# Altium project STM32_Display.PrjPcb
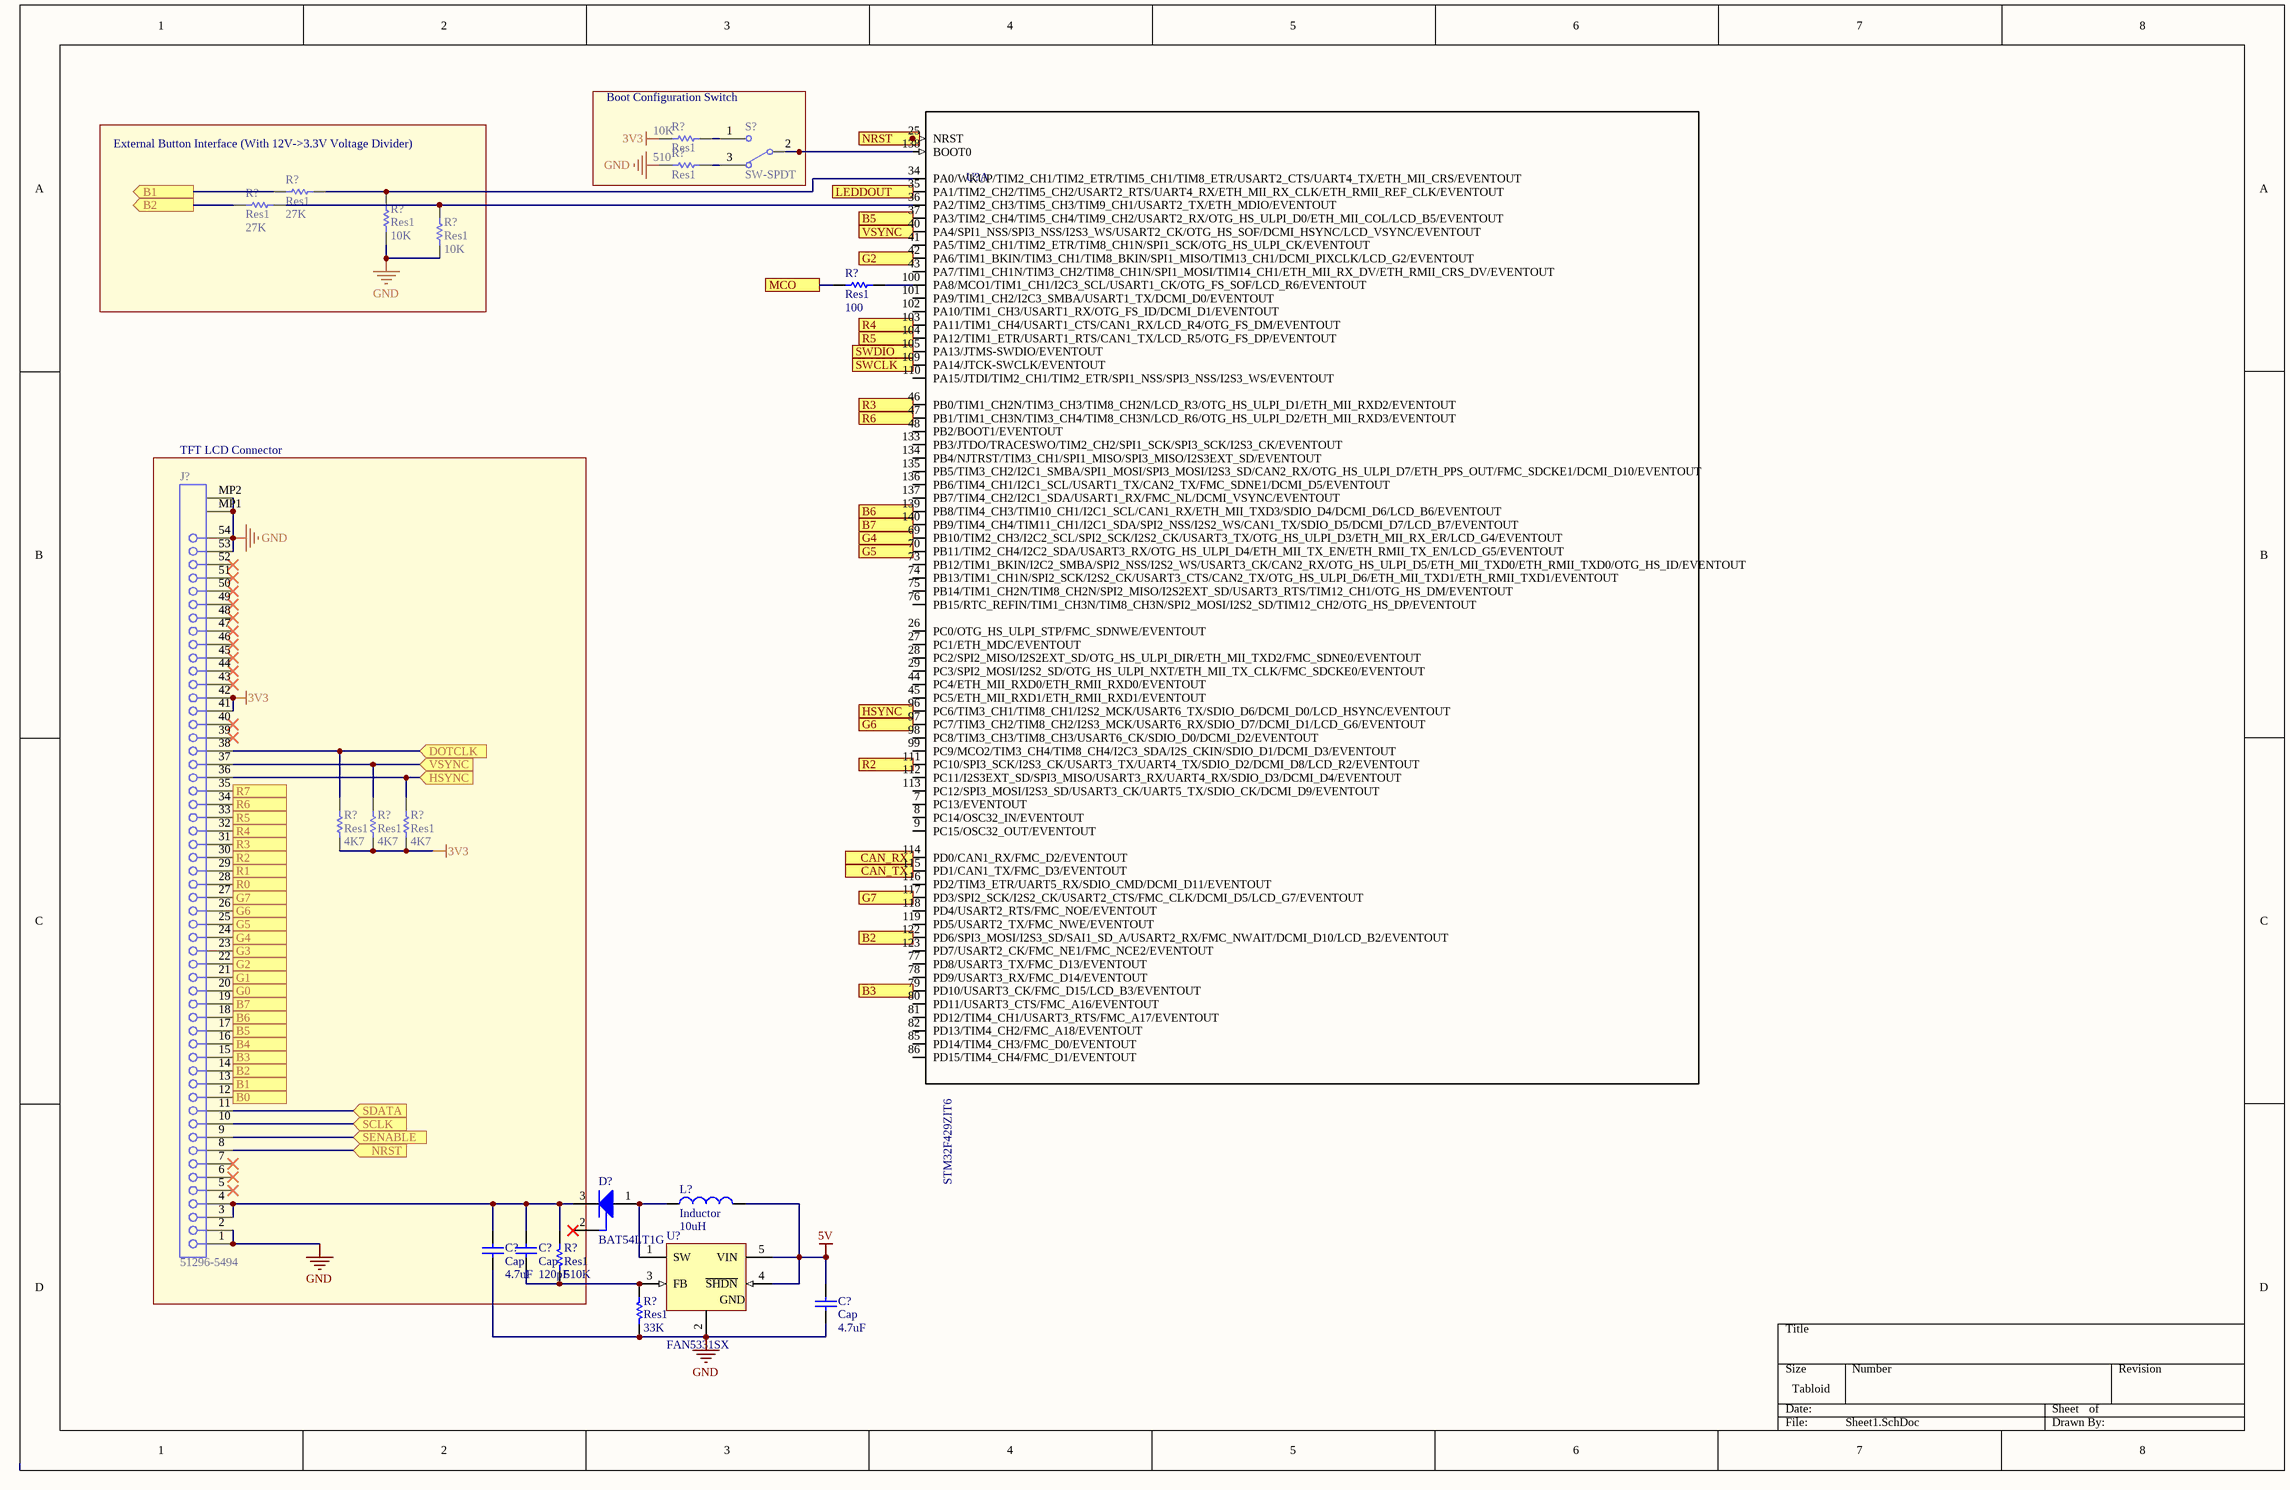
[diagram p0: Sheet1.SchDoc]
4 sheets, 108 parts. Net scope: flat (ports and power ports of the same name join across sheets).
Sheets:
  Sheet1.SchDoc
  Sheet2.SchDoc
  Sheet3.SchDoc
  Sheet4.SchDoc

## Sheet Sheet1.SchDoc
size Tabloid

### Parts
(Parts that share a designator on the sheet are numbered #1, #2 ... from top to bottom, then left to right.)
C?#1  Cap  value 4.7uF  [RAD-0.3]
C?#2  Cap  value 120pF  [RAD-0.3]
C?#3  Cap  value 4.7uF  [RAD-0.3]
D?  BAT54LT1G  [ONSC-SOT-23-3-318-08_V]
J?#1  51296-5494  [MOLX-51296-5494]
L?  Inductor  value 10uH  [0402-A]
R?#1  Res1  value 10K  [AXIAL-0.3]
R?#2  Res1  value 510  [AXIAL-0.3]
R?#3  Res1  value 27K  [AXIAL-0.3]
R?#4  Res1  value 27K  [AXIAL-0.3]
R?#5  Res1  value 10K  [AXIAL-0.3]
R?#6  Res1  value 10K  [AXIAL-0.3]
R?#7  Res1  value 100  [AXIAL-0.3]
R?#8  Res1  value 4K7  [AXIAL-0.3]
R?#9  Res1  value 4K7  [AXIAL-0.3]
R?#10  Res1  value 4K7  [AXIAL-0.3]
R?#11  Res1  value 510K  [AXIAL-0.3]
R?#12  Res1  value 33K  [AXIAL-0.3]
S?  SW-SPDT  [TL36WW15050]
U?#1  STM32F429ZIT6  [*QFP50P2200X2200X160-144N]  (part A of 2)
U?#2  FAN5331SX  [DBV0005A_L]

### Blocks framed on the sheet
Boot Configuration Switch: R?#1 R?#2 S?
External Button Interface (With 12V->3.3V Voltage Divider): R?#3-R?#6
TFT LCD Connector: C?#1 C?#2 J?#1 R?#8-R?#11

### Ports
B0 (in), B1 (in), B1 (out), B2 (in), B2 (out), B3 (in), B4 (in), B5 (in), B6 (in), B7 (in), CAN_RX, CAN_TX, DOTCLK (in), G0 (in), G1 (in), G2 (in), G3 (in), G4 (in), G5 (in), G6 (in), G7 (in), HSYNC (in), LEDDOUT, MCO, NRST (in), R0 (in), R1 (in), R2 (in), R3 (in), R4 (in), R5 (in), R6 (in), R7 (in), SCLK (in), SDATA (in), SENABLE (in), SWCLK (in), SWDIO (in), VSYNC (in)

### Nets
3V3: J?#1.41 J?#1.42 R?#1.1 R?#8.1 R?#9.1 R?#10.1
5V: C?#3.1 L?.1 U?#2.4(~{SHDN}) U?#2.5(VIN)
GND: C?#1.2 C?#3.2 J?#1.1 J?#1.2 J?#1.53 J?#1.54 J?#1.MP1 J?#1.MP2 R?#2.1 R?#5.1 R?#6.1 R?#12.1 U?#2.2(GND)
Net?#16_2: J?#1.8 ; port NRST
NetC?#1_1: C?#1.1 C?#2.1 D?.3(K) J?#1.3 J?#1.4 R?#11.2
NetC?#2_2: C?#2.2 R?#11.1 R?#12.2 U?#2.3(FB)
NetD?_1: D?.1(A) L?.2 U?#2.1(SW)
NetJ?#1_9: J?#1.9 ; port SENABLE
NetJ?#1_10: J?#1.10 ; port SCLK
NetJ?#1_11: J?#1.11 ; port SDATA
NetJ?#1_12: J?#1.12 ; port B0
NetJ?#1_13: J?#1.13 R?#3.2 ; port B1
NetJ?#1_14: J?#1.14 R?#4.2 U?#1.122(PD6/SPI3_MOSI/I2S3_SD/SAI1_SD_A/USART2_RX/FMC_NWAIT/DCMI_D10/LCD_B2/EVENTOUT) ; port B2
NetJ?#1_15: J?#1.15 U?#1.79(PD10/USART3_CK/FMC_D15/LCD_B3/EVENTOUT) ; port B3
NetJ?#1_16: J?#1.16 ; port B4
NetJ?#1_17: J?#1.17 U?#1.37(PA3/TIM2_CH4/TIM5_CH4/TIM9_CH2/USART2_RX/OTG_HS_ULPI_D0/ETH_MII_COL/LCD_B5/EVENTOUT) ; port B5
NetJ?#1_18: J?#1.18 U?#1.139(PB8/TIM4_CH3/TIM10_CH1/I2C1_SCL/CAN1_RX/ETH_MII_TXD3/SDIO_D4/DCMI_D6/LCD_B6/EVENTOUT) ; port B6
NetJ?#1_19: J?#1.19 U?#1.140(PB9/TIM4_CH4/TIM11_CH1/I2C1_SDA/SPI2_NSS/I2S2_WS/CAN1_TX/SDIO_D5/DCMI_D7/LCD_B7/EVENTOUT) ; port B7
NetJ?#1_20: J?#1.20 ; port G0
NetJ?#1_21: J?#1.21 ; port G1
NetJ?#1_22: J?#1.22 U?#1.42(PA6/TIM1_BKIN/TIM3_CH1/TIM8_BKIN/SPI1_MISO/TIM13_CH1/DCMI_PIXCLK/LCD_G2/EVENTOUT) ; port G2
NetJ?#1_23: J?#1.23 ; port G3
NetJ?#1_24: J?#1.24 U?#1.69(PB10/TIM2_CH3/I2C2_SCL/SPI2_SCK/I2S2_CK/USART3_TX/OTG_HS_ULPI_D3/ETH_MII_RX_ER/LCD_G4/EVENTOUT) ; port G4
NetJ?#1_25: J?#1.25 U?#1.70(PB11/TIM2_CH4/I2C2_SDA/USART3_RX/OTG_HS_ULPI_D4/ETH_MII_TX_EN/ETH_RMII_TX_EN/LCD_G5/EVENTOUT) ; port G5
NetJ?#1_26: J?#1.26 U?#1.97(PC7/TIM3_CH2/TIM8_CH2/I2S3_MCK/USART6_RX/SDIO_D7/DCMI_D1/LCD_G6/EVENTOUT) ; port G6
NetJ?#1_27: J?#1.27 U?#1.117(PD3/SPI2_SCK/I2S2_CK/USART2_CTS/FMC_CLK/DCMI_D5/LCD_G7/EVENTOUT) ; port G7
NetJ?#1_28: J?#1.28 ; port R0
NetJ?#1_29: J?#1.29 ; port R1
NetJ?#1_30: J?#1.30 U?#1.111(PC10/SPI3_SCK/I2S3_CK/USART3_TX/UART4_TX/SDIO_D2/DCMI_D8/LCD_R2/EVENTOUT) ; port R2
NetJ?#1_31: J?#1.31 U?#1.46(PB0/TIM1_CH2N/TIM3_CH3/TIM8_CH2N/LCD_R3/OTG_HS_ULPI_D1/ETH_MII_RXD2/EVENTOUT) ; port R3
NetJ?#1_32: J?#1.32 U?#1.103(PA11/TIM1_CH4/USART1_CTS/CAN1_RX/LCD_R4/OTG_FS_DM/EVENTOUT) ; port R4
NetJ?#1_33: J?#1.33 U?#1.104(PA12/TIM1_ETR/USART1_RTS/CAN1_TX/LCD_R5/OTG_FS_DP/EVENTOUT) ; port R5
NetJ?#1_34: J?#1.34 U?#1.47(PB1/TIM1_CH3N/TIM3_CH4/TIM8_CH3N/LCD_R6/OTG_HS_ULPI_D2/ETH_MII_RXD3/EVENTOUT) ; port R6
NetJ?#1_35: J?#1.35 ; port R7
NetJ?#1_36: J?#1.36 R?#10.2 U?#1.96(PC6/TIM3_CH1/TIM8_CH1/I2S2_MCK/USART6_TX/SDIO_D6/DCMI_D0/LCD_HSYNC/EVENTOUT) ; port HSYNC
NetJ?#1_37: J?#1.37 R?#9.2 U?#1.40(PA4/SPI1_NSS/SPI3_NSS/I2S3_WS/USART2_CK/OTG_HS_SOF/DCMI_HSYNC/LCD_VSYNC/EVENTOUT) ; port VSYNC
NetJ?#1_38: J?#1.38 R?#8.2 ; port DOTCLK
NetP?#2_2: U?#1.109(PA14/JTCK-SWCLK/EVENTOUT) ; port SWCLK
NetP?#2_4: U?#1.105(PA13/JTMS-SWDIO/EVENTOUT) ; port SWDIO
NetR?#1_2: R?#1.2 S?.1
NetR?#2_2: R?#2.2 S?.3
NetR?#3_1: R?#3.1 R?#5.2 U?#1.34(PA0/WKUP/TIM2_CH1/TIM2_ETR/TIM5_CH1/TIM8_ETR/USART2_CTS/UART4_TX/ETH_MII_CRS/EVENTOUT)
NetR?#4_1: R?#4.1 R?#6.2 U?#1.36(PA2/TIM2_CH3/TIM5_CH3/TIM9_CH1/USART2_TX/ETH_MDIO/EVENTOUT)
NetR?#7_1: R?#7.1 ; port MCO
NetR?#7_2: R?#7.2 U?#1.100(PA8/MCO1/TIM1_CH1/I2C3_SCL/USART1_CK/OTG_FS_SOF/LCD_R6/EVENTOUT)
NetS?_2: S?.2 U?#1.138(BOOT0)
NetU?#1_35: U?#1.35(PA1/TIM2_CH2/TIM5_CH2/USART2_RTS/UART4_RX/ETH_MII_RX_CLK/ETH_RMII_REF_CLK/EVENTOUT) ; port LEDDOUT
NetU?#1_114: U?#1.114(PD0/CAN1_RX/FMC_D2/EVENTOUT) ; port CAN_RX
NetU?#1_115: U?#1.115(PD1/CAN1_TX/FMC_D3/EVENTOUT) ; port CAN_TX

Not connected (* = marked no-connect by the designer): D? 2(NC)*; J?#1 5* 6* 7* 39* 40* 43* 44* 45* 46* 47* 48* 49* 50* 51* 52*; U?#1 7(PC13/EVENTOUT) 8(PC14/OSC32_IN/EVENTOUT) 9(PC15/OSC32_OUT/EVENTOUT) 25(NRST) 26(PC0/OTG_HS_ULPI_STP/FMC_SDNWE/EVENTOUT) 27(PC1/ETH_MDC/EVENTOUT) 28(PC2/SPI2_MISO/I2S2EXT_SD/OTG_HS_ULPI_DIR/ETH_MII_TXD2/FMC_SDNE0/EVENTOUT) 29(PC3/SPI2_MOSI/I2S2_SD/OTG_HS_ULPI_NXT/ETH_MII_TX_CLK/FMC_SDCKE0/EVENTOUT) 41(PA5/TIM2_CH1/TIM2_ETR/TIM8_CH1N/SPI1_SCK/OTG_HS_ULPI_CK/EVENTOUT) 43(PA7/TIM1_CH1N/TIM3_CH2/TIM8_CH1N/SPI1_MOSI/TIM14_CH1/ETH_MII_RX_DV/ETH_RMII_CRS_DV/EVENTOUT) 44(PC4/ETH_MII_RXD0/ETH_RMII_RXD0/EVENTOUT) 45(PC5/ETH_MII_RXD1/ETH_RMII_RXD1/EVENTOUT) 48(PB2/BOOT1/EVENTOUT) 73(PB12/TIM1_BKIN/I2C2_SMBA/SPI2_NSS/I2S2_WS/USART3_CK/CAN2_RX/OTG_HS_ULPI_D5/ETH_MII_TXD0/ETH_RMII_TXD0/OTG_HS_ID/EVENTOUT) 74(PB13/TIM1_CH1N/SPI2_SCK/I2S2_CK/USART3_CTS/CAN2_TX/OTG_HS_ULPI_D6/ETH_MII_TXD1/ETH_RMII_TXD1/EVENTOUT) 75(PB14/TIM1_CH2N/TIM8_CH2N/SPI2_MISO/I2S2EXT_SD/USART3_RTS/TIM12_CH1/OTG_HS_DM/EVENTOUT) 76(PB15/RTC_REFIN/TIM1_CH3N/TIM8_CH3N/SPI2_MOSI/I2S2_SD/TIM12_CH2/OTG_HS_DP/EVENTOUT) 77(PD8/USART3_TX/FMC_D13/EVENTOUT) 78(PD9/USART3_RX/FMC_D14/EVENTOUT) 80(PD11/USART3_CTS/FMC_A16/EVENTOUT) 81(PD12/TIM4_CH1/USART3_RTS/FMC_A17/EVENTOUT) 82(PD13/TIM4_CH2/FMC_A18/EVENTOUT) 85(PD14/TIM4_CH3/FMC_D0/EVENTOUT) 86(PD15/TIM4_CH4/FMC_D1/EVENTOUT) 98(PC8/TIM3_CH3/TIM8_CH3/USART6_CK/SDIO_D0/DCMI_D2/EVENTOUT) 99(PC9/MCO2/TIM3_CH4/TIM8_CH4/I2C3_SDA/I2S_CKIN/SDIO_D1/DCMI_D3/EVENTOUT) 101(PA9/TIM1_CH2/I2C3_SMBA/USART1_TX/DCMI_D0/EVENTOUT) 102(PA10/TIM1_CH3/USART1_RX/OTG_FS_ID/DCMI_D1/EVENTOUT) 110(PA15/JTDI/TIM2_CH1/TIM2_ETR/SPI1_NSS/SPI3_NSS/I2S3_WS/EVENTOUT) 112(PC11/I2S3EXT_SD/SPI3_MISO/USART3_RX/UART4_RX/SDIO_D3/DCMI_D4/EVENTOUT) 113(PC12/SPI3_MOSI/I2S3_SD/USART3_CK/UART5_TX/SDIO_CK/DCMI_D9/EVENTOUT) 116(PD2/TIM3_ETR/UART5_RX/SDIO_CMD/DCMI_D11/EVENTOUT) 118(PD4/USART2_RTS/FMC_NOE/EVENTOUT) 119(PD5/USART2_TX/FMC_NWE/EVENTOUT) 123(PD7/USART2_CK/FMC_NE1/FMC_NCE2/EVENTOUT) 133(PB3/JTDO/TRACESWO/TIM2_CH2/SPI1_SCK/SPI3_SCK/I2S3_CK/EVENTOUT) 134(PB4/NJTRST/TIM3_CH1/SPI1_MISO/SPI3_MISO/I2S3EXT_SD/EVENTOUT) 135(PB5/TIM3_CH2/I2C1_SMBA/SPI1_MOSI/SPI3_MOSI/I2S3_SD/CAN2_RX/OTG_HS_ULPI_D7/ETH_PPS_OUT/FMC_SDCKE1/DCMI_D10/EVENTOUT) 136(PB6/TIM4_CH1/I2C1_SCL/USART1_TX/CAN2_TX/FMC_SDNE1/DCMI_D5/EVENTOUT) 137(PB7/TIM4_CH2/I2C1_SDA/USART1_RX/FMC_NL/DCMI_VSYNC/EVENTOUT)

### Library data of the parts
C?#1-C?#3 = Cap: Capacitor; Published: 8-Jun-2000; LatestRevisionDate: 17-Jul-2002; LatestRevisionNote: Re-released for DXP Platform.; PackageReference: RAD-0.3; Publisher: Altium Limited; PackageDescription: Radial Cap, Thru-Hole; 2 Leads; 0.3 in Pin Spacing
D? = CMP-1055-00534-1: Schottky Barrier Diode, 3-Pin SOT-23, Pb-Free, Tape and Reel; Manufacturer: On Semiconductor; IFSM Max (A): 0.6; Configuration: Single; trr Max (ns): 5; PackageVersion: Rev. AP, 11/2009; ComponentLink3Description: Package Specification; RoHS: TRUE; ComponentLink3URL: http://www.onsemi.cn/pub_link/Collateral/318-08.PDF; PackageDescription: 3-Pin Small Outline Transistor, Body 2.92 x 1.3 mm, Pitch 0.95 mm; DatasheetVersion: Rev. 12; ComponentLink1Description: Manufacturer URL; PartNumber: BAT54LT1G; ComponentLink2Description: Datasheet; Mounting Technology: Surface Mount; PackageReference: SOT-23-3-318-08; ComponentLink2URL: http://www.onsemi.cn/pub_link/Collateral/BAT54LT1-D.PDF; ComponentLink1URL: http://www.onsemi.com/; Packing: Tape and Reel
J?#1 = CMP-1241-00166-1: 0.5 mm Pitch Easy-On(TM) Type FPC Connector, 1.3 mm Mated Height, Right Angle, ZIF, SMT, Bottom Contact, 54 Circuits, -20 to 85 degC, ELV and RoHS Compliant, Tape and Reel; Manufacturer: Molex; Entry Angle: 90degrees Angle; Pitch - Mating Interface: 0.50mm; Durability (mating cycles max): 20; Polarized to PCB: Yes; Voltage (Max): 50V AC (RMS)/DC; Material - Metal: Phosphor Bronze; Stackable: No; Mated Height: 1.30mm; Circuits (Loaded): 54; Material - Plating Termination: Gold; Current (Max per Contact): 0.5A; Contact Position: Bottom; Orientation: Right Angle; Number of Rows: 1; ComponentLink3Description: Package Specification; ComponentLink3URL: http://www.molex.com/pdm_docs/sd/512965494_sd.pdf; PackageVersion: Rev. G, 02/2011; ComponentLink1URL: http://www.molex.com/molex/index.jsp; PackageReference: 51296-5494; ComponentLink2Description: Datasheet; ComponentLink1Description: Manufacturer URL; Mounting Technology: Surface Mount; PCB Retention: Yes; PartNumber: 51296-5494; PCB Locator: No; ComponentLink2URL: http://www.molex.com/webdocs/datasheets/pdf/en-us/0512965494_FFC_FPC_CONNECTORS.pdf; PackageDescription: 54-Lead FPC Connector, Pitch 0.5 mm; Packing: Tape and Reel; Material - Plating Mating: Gold; RoHS: TRUE
L? = Inductor: Code_IEC: 1005; Published: 8-Jun-2000; LatestRevisionDate: 29-May-2009; LatestRevisionNote: IPC-7351 Footprint Added.; PackageReference: 0402-A; Publisher: Altium Limited; PackageDescription: Chip Inductor; Code_JEITA: 0402
R?#1-R?#12 = Res1: Resistor; Published: 8-Jun-2000; LatestRevisionDate: 17-Jul-2002; LatestRevisionNote: Re-released for DXP Platform.; PackageReference: AXIAL-0.3; Publisher: Altium Limited; PackageDescription: Axial Device, Thru-Hole; 2 Leads; 0.3 in Pin Spacing
S? = SW-SPDT: SPDT Subminiature Toggle Switch, Right Angle Mounting, Vertical Actuation; Published: 24-Mar-1999; LatestRevisionDate: 17-Dec-2003; LatestRevisionNote: Schematic revised, PCB Footprint replaced.; DatasheetVersion: 05-Dec-2000; PackageReference: TL36WW15050; Publisher: Altium Limited; PackageDescription: Switch; 4 Leads; ComponentLink1Description: Manufacturer Link; ComponentLink1URL: http://www.apem.com
U?#1 = STM32F429ZIT6: High-performance and DSP with FPU, ARM Cortex-M4 MCU with 2 Mbytes Flash, 180 MHz CPU, Art Accelerator, SDRAM, TFT; MF: STMicroelectronics; Digi-Key_Part_Number: 497-14053-ND; SnapEDA_Link: https://www.snapeda.com/parts/STM32F429ZIT6/STMicroelectronics/view-part/?ref=snap; MP: STM32F429ZIT6; Package: LQFP-144 STMicroelectronics; Digi-Key_Purchase_URL: https://www.digikey.com/product-detail/en/stmicroelectronics/STM32F429ZIT6/497-14053-ND/4357427?utm_source=snapeda&utm_medium=aggregator&utm_campaign=symbol; Value: *
U?#2 = CMP-0063-01104-3: Manufacturer: Texas Instruments; PackageTopMarking: S59B*XTT; CompType: MiscPower; PowerWise: N; ComponentLink1Description: Datasheet URL; ComponentLink1URL: http://www.ti.com/general/docs/lit/getliterature.tsp?genericPartNumber=LM2705&fileType=pdf; PinCount: 5; PackageDescription: Molded SOT-23, .115 x .063 x .040 in Body, 5 Lead, .0375 in Pitch; PackageReference: DBV0005A; RoHS: Y

## Sheet Sheet2.SchDoc
size Tabloid
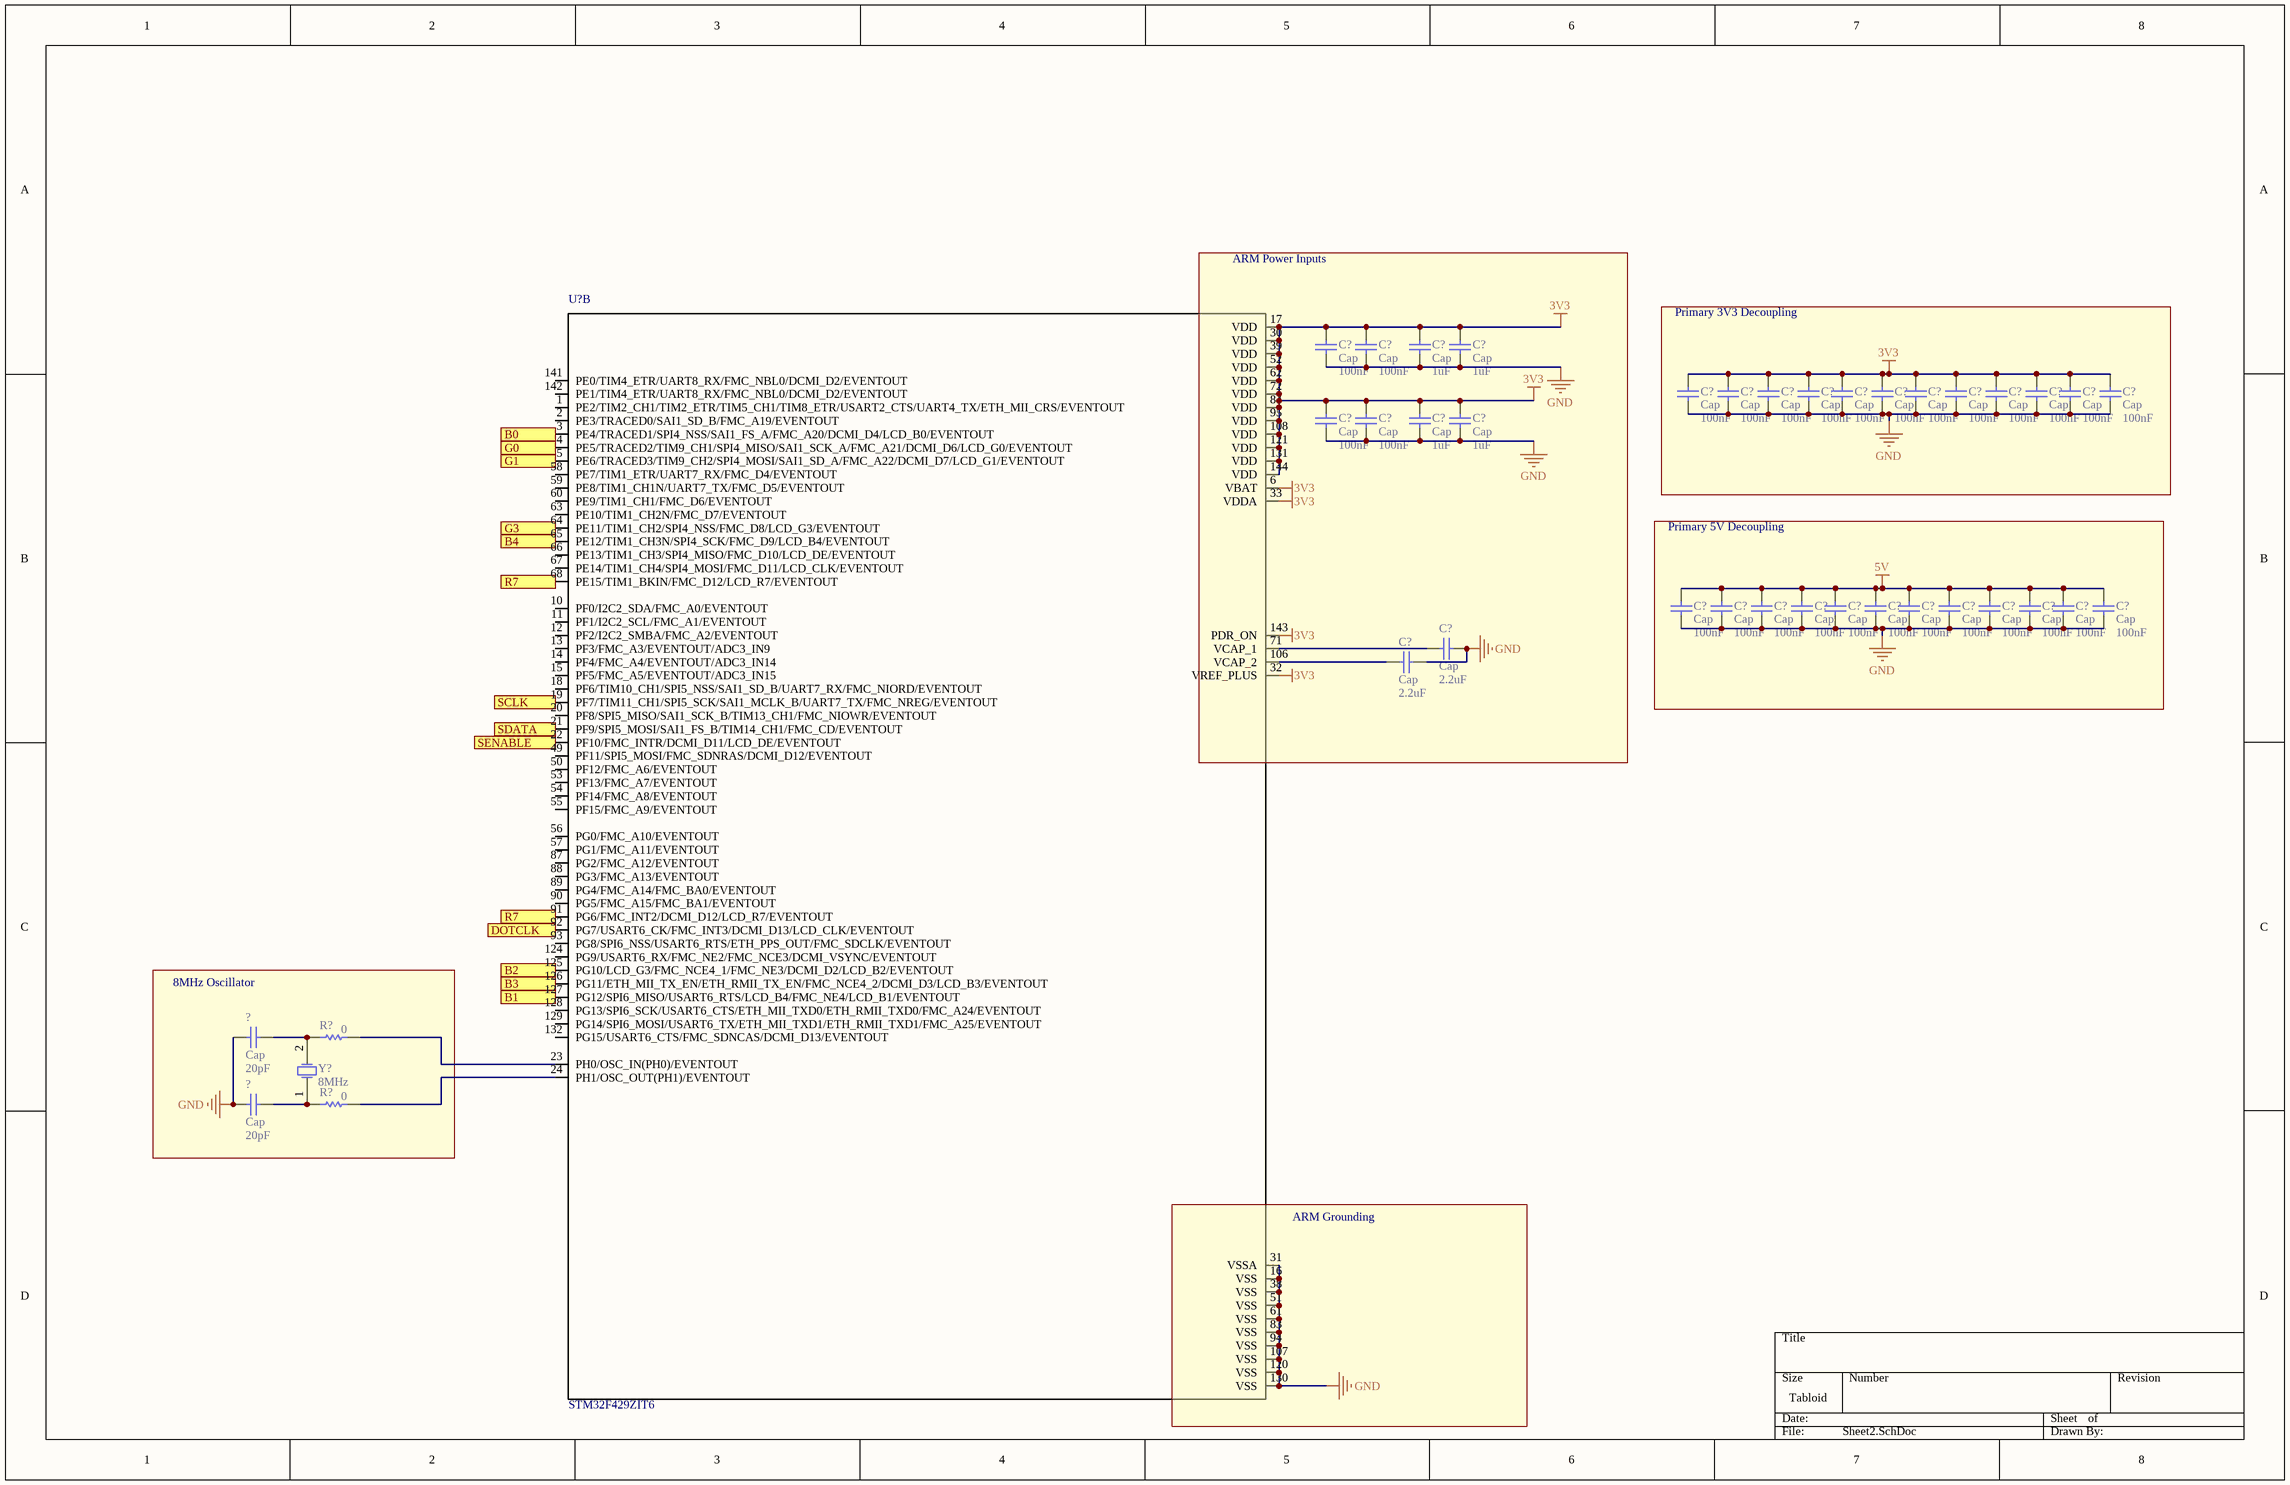
[diagram p1: Sheet2.SchDoc]

### Parts
(Parts that share a designator on the sheet are numbered #1, #2 ... from top to bottom, then left to right.)
?#1  Cap  value 20pF  [RAD-0.3]
?#2  Cap  value 20pF  [RAD-0.3]
C?#4  Cap  value 100nF  [RAD-0.3]
C?#5  Cap  value 100nF  [RAD-0.3]
C?#6  Cap  value 1uF  [RAD-0.3]
C?#7  Cap  value 1uF  [RAD-0.3]
C?#8  Cap  value 100nF  [RAD-0.3]
C?#9  Cap  value 100nF  [RAD-0.3]
C?#10  Cap  value 100nF  [RAD-0.3]
C?#11  Cap  value 100nF  [RAD-0.3]
C?#12  Cap  value 100nF  [RAD-0.3]
C?#13  Cap  value 100nF  [RAD-0.3]
C?#14  Cap  value 100nF  [RAD-0.3]
C?#15  Cap  value 100nF  [RAD-0.3]
C?#16  Cap  value 100nF  [RAD-0.3]
C?#17  Cap  value 100nF  [RAD-0.3]
C?#18  Cap  value 100nF  [RAD-0.3]
C?#19  Cap  value 100nF  [RAD-0.3]
C?#20  Cap  value 100nF  [RAD-0.3]
C?#21  Cap  value 100nF  [RAD-0.3]
C?#22  Cap  value 1uF  [RAD-0.3]
C?#23  Cap  value 1uF  [RAD-0.3]
C?#24  Cap  value 100nF  [RAD-0.3]
C?#25  Cap  value 100nF  [RAD-0.3]
C?#26  Cap  value 100nF  [RAD-0.3]
C?#27  Cap  value 100nF  [RAD-0.3]
C?#28  Cap  value 100nF  [RAD-0.3]
C?#29  Cap  value 100nF  [RAD-0.3]
C?#30  Cap  value 100nF  [RAD-0.3]
C?#31  Cap  value 100nF  [RAD-0.3]
C?#32  Cap  value 100nF  [RAD-0.3]
C?#33  Cap  value 100nF  [RAD-0.3]
C?#34  Cap  value 100nF  [RAD-0.3]
C?#35  Cap  value 100nF  [RAD-0.3]
C?#36  Cap  value 2.2uF  [RAD-0.3]
C?#37  Cap  value 2.2uF  [RAD-0.3]
R?#13  value 0  [AXIAL-0.3]  (hidden comment: Res1)
R?#14  value 0  [AXIAL-0.3]  (hidden comment: Res1)
U?#3  STM32F429ZIT6  [*QFP50P2200X2200X160-144N]  (part B of 2)
Y?  8MHz  [R38]

### Blocks framed on the sheet
ARM Power Inputs: C?#4-C?#7 C?#20-C?#23 C?#36 C?#37
Primary 3V3 Decoupling: C?#8-C?#19
Primary 5V Decoupling: C?#24-C?#35
8MHz Oscillator: ?#1 ?#2 R?#13 R?#14 Y?

### Ports
B0 (in), B1 (in), B2 (in), B3 (in), B4 (in), DOTCLK (in), G0 (in), G1 (in), G3 (in), R7 (in), SCLK (in), SDATA (in), SENABLE (in)

### Nets
3V3: C?#4.1 C?#5.1 C?#6.1 C?#7.1 C?#8.1 C?#9.1 C?#10.1 C?#11.1 C?#12.1 C?#13.1 C?#14.1 C?#15.1 C?#16.1 C?#17.1 C?#18.1 C?#19.1 C?#20.1 C?#21.1 C?#22.1 C?#23.1 U?#3.6(VBAT) U?#3.17(VDD) U?#3.30(VDD) U?#3.32(VREF_PLUS) U?#3.33(VDDA) U?#3.39(VDD) U?#3.52(VDD) U?#3.62(VDD) U?#3.72(VDD) U?#3.84(VDD) U?#3.95(VDD) U?#3.108(VDD) U?#3.121(VDD) U?#3.131(VDD) U?#3.143(PDR_ON) U?#3.144(VDD)
5V: C?#24.1 C?#25.1 C?#26.1 C?#27.1 C?#28.1 C?#29.1 C?#30.1 C?#31.1 C?#32.1 C?#33.1 C?#34.1 C?#35.1
GND: ?#1.2 ?#2.2 C?#4.2 C?#5.2 C?#6.2 C?#7.2 C?#8.2 C?#9.2 C?#10.2 C?#11.2 C?#12.2 C?#13.2 C?#14.2 C?#15.2 C?#16.2 C?#17.2 C?#18.2 C?#19.2 C?#20.2 C?#21.2 C?#22.2 C?#23.2 C?#24.2 C?#25.2 C?#26.2 C?#27.2 C?#28.2 C?#29.2 C?#30.2 C?#31.2 C?#32.2 C?#33.2 C?#34.2 C?#35.2 C?#36.1 C?#37.1 U?#3.16(VSS) U?#3.31(VSSA) U?#3.38(VSS) U?#3.51(VSS) U?#3.61(VSS) U?#3.83(VSS) U?#3.94(VSS) U?#3.107(VSS) U?#3.120(VSS) U?#3.130(VSS)
Net?#1_1: ?#1.1 R?#13.2 Y?.2(OSC2)
Net?#2_1: ?#2.1 R?#14.2 Y?.1(OSC1)
NetC?#36_2: C?#36.2 U?#3.71(VCAP_1)
NetC?#37_2: C?#37.2 U?#3.106(VCAP_2)
NetJ?#1_9: U?#3.22(PF10/FMC_INTR/DCMI_D11/LCD_DE/EVENTOUT) ; port SENABLE
NetJ?#1_10: U?#3.19(PF7/TIM11_CH1/SPI5_SCK/SAI1_MCLK_B/UART7_TX/FMC_NREG/EVENTOUT) ; port SCLK
NetJ?#1_11: U?#3.21(PF9/SPI5_MOSI/SAI1_FS_B/TIM14_CH1/FMC_CD/EVENTOUT) ; port SDATA
NetJ?#1_12: U?#3.3(PE4/TRACED1/SPI4_NSS/SAI1_FS_A/FMC_A20/DCMI_D4/LCD_B0/EVENTOUT) ; port B0
NetJ?#1_13: U?#3.127(PG12/SPI6_MISO/USART6_RTS/LCD_B4/FMC_NE4/LCD_B1/EVENTOUT) ; port B1
NetJ?#1_14: U?#3.125(PG10/LCD_G3/FMC_NCE4_1/FMC_NE3/DCMI_D2/LCD_B2/EVENTOUT) ; port B2
NetJ?#1_15: U?#3.126(PG11/ETH_MII_TX_EN/ETH_RMII_TX_EN/FMC_NCE4_2/DCMI_D3/LCD_B3/EVENTOUT) ; port B3
NetJ?#1_16: U?#3.65(PE12/TIM1_CH3N/SPI4_SCK/FMC_D9/LCD_B4/EVENTOUT) ; port B4
NetJ?#1_20: U?#3.4(PE5/TRACED2/TIM9_CH1/SPI4_MISO/SAI1_SCK_A/FMC_A21/DCMI_D6/LCD_G0/EVENTOUT) ; port G0
NetJ?#1_21: U?#3.5(PE6/TRACED3/TIM9_CH2/SPI4_MOSI/SAI1_SD_A/FMC_A22/DCMI_D7/LCD_G1/EVENTOUT) ; port G1
NetJ?#1_23: U?#3.64(PE11/TIM1_CH2/SPI4_NSS/FMC_D8/LCD_G3/EVENTOUT) ; port G3
NetJ?#1_35: U?#3.68(PE15/TIM1_BKIN/FMC_D12/LCD_R7/EVENTOUT) U?#3.91(PG6/FMC_INT2/DCMI_D12/LCD_R7/EVENTOUT) ; port R7
NetJ?#1_38: U?#3.92(PG7/USART6_CK/FMC_INT3/DCMI_D13/LCD_CLK/EVENTOUT) ; port DOTCLK
NetR?#13_1: R?#13.1 U?#3.23(PH0/OSC_IN(PH0)/EVENTOUT)
NetR?#14_1: R?#14.1 U?#3.24(PH1/OSC_OUT(PH1)/EVENTOUT)

Not connected (* = marked no-connect by the designer): U?#3 1(PE2/TIM2_CH1/TIM2_ETR/TIM5_CH1/TIM8_ETR/USART2_CTS/UART4_TX/ETH_MII_CRS/EVENTOUT) 2(PE3/TRACED0/SAI1_SD_B/FMC_A19/EVENTOUT) 10(PF0/I2C2_SDA/FMC_A0/EVENTOUT) 11(PF1/I2C2_SCL/FMC_A1/EVENTOUT) 12(PF2/I2C2_SMBA/FMC_A2/EVENTOUT) 13(PF3/FMC_A3/EVENTOUT/ADC3_IN9) 14(PF4/FMC_A4/EVENTOUT/ADC3_IN14) 15(PF5/FMC_A5/EVENTOUT/ADC3_IN15) 18(PF6/TIM10_CH1/SPI5_NSS/SAI1_SD_B/UART7_RX/FMC_NIORD/EVENTOUT) 20(PF8/SPI5_MISO/SAI1_SCK_B/TIM13_CH1/FMC_NIOWR/EVENTOUT) 49(PF11/SPI5_MOSI/FMC_SDNRAS/DCMI_D12/EVENTOUT) 50(PF12/FMC_A6/EVENTOUT) 53(PF13/FMC_A7/EVENTOUT) 54(PF14/FMC_A8/EVENTOUT) 55(PF15/FMC_A9/EVENTOUT) 56(PG0/FMC_A10/EVENTOUT) 57(PG1/FMC_A11/EVENTOUT) 58(PE7/TIM1_ETR/UART7_RX/FMC_D4/EVENTOUT) 59(PE8/TIM1_CH1N/UART7_TX/FMC_D5/EVENTOUT) 60(PE9/TIM1_CH1/FMC_D6/EVENTOUT) 63(PE10/TIM1_CH2N/FMC_D7/EVENTOUT) 66(PE13/TIM1_CH3/SPI4_MISO/FMC_D10/LCD_DE/EVENTOUT) 67(PE14/TIM1_CH4/SPI4_MOSI/FMC_D11/LCD_CLK/EVENTOUT) 87(PG2/FMC_A12/EVENTOUT) 88(PG3/FMC_A13/EVENTOUT) 89(PG4/FMC_A14/FMC_BA0/EVENTOUT) 90(PG5/FMC_A15/FMC_BA1/EVENTOUT) 93(PG8/SPI6_NSS/USART6_RTS/ETH_PPS_OUT/FMC_SDCLK/EVENTOUT) 124(PG9/USART6_RX/FMC_NE2/FMC_NCE3/DCMI_VSYNC/EVENTOUT) 128(PG13/SPI6_SCK/USART6_CTS/ETH_MII_TXD0/ETH_RMII_TXD0/FMC_A24/EVENTOUT) 129(PG14/SPI6_MOSI/USART6_TX/ETH_MII_TXD1/ETH_RMII_TXD1/FMC_A25/EVENTOUT) 132(PG15/USART6_CTS/FMC_SDNCAS/DCMI_D13/EVENTOUT) 141(PE0/TIM4_ETR/UART8_RX/FMC_NBL0/DCMI_D2/EVENTOUT) 142(PE1/TIM4_ETR/UART8_RX/FMC_NBL0/DCMI_D2/EVENTOUT)

### Notes on the sheet
- (near U?#3) ARM Grounding

### Library data of the parts
?#1 ?#2 C?#4-C?#37 = Cap: Capacitor; Published: 8-Jun-2000; LatestRevisionDate: 17-Jul-2002; LatestRevisionNote: Re-released for DXP Platform.; PackageReference: RAD-0.3; Publisher: Altium Limited; PackageDescription: Radial Cap, Thru-Hole; 2 Leads; 0.3 in Pin Spacing
R?#13 R?#14 = Res1: Resistor; Published: 8-Jun-2000; LatestRevisionDate: 17-Jul-2002; LatestRevisionNote: Re-released for DXP Platform.; PackageReference: AXIAL-0.3; Publisher: Altium Limited; PackageDescription: Axial Device, Thru-Hole; 2 Leads; 0.3 in Pin Spacing
U?#3 = STM32F429ZIT6: as U?#1 on sheet Sheet1; Digi-Key_Part_Number: 497-14053-ND; SnapEDA_Link: https://www.snapeda.com/parts/STM32F429ZIT6/STMicroelectronics/view-part/?ref=snap; MP: STM32F429ZIT6; Package: LQFP-144 STMicroelectronics; Digi-Key_Purchase_URL: https://www.digikey.com/product-detail/en/stmicroelectronics/STM32F429ZIT6/497-14053-ND/4357427?utm_source=snapeda&utm_medium=aggregator&utm_campaign=symbol; Value: *
Y? = XTAL: Crystal Oscillator; Published: 8-Jun-2000; LatestRevisionDate: 17-Jul-2002; LatestRevisionNote: Re-released for DXP Platform.; PackageReference: R38; Publisher: Altium Limited; PackageDescription: Crystal, Thru-Hole; 2 Leads; Body 3.1 x 8.2 mm (Dia.xH)

## Sheet Sheet3.SchDoc
size A
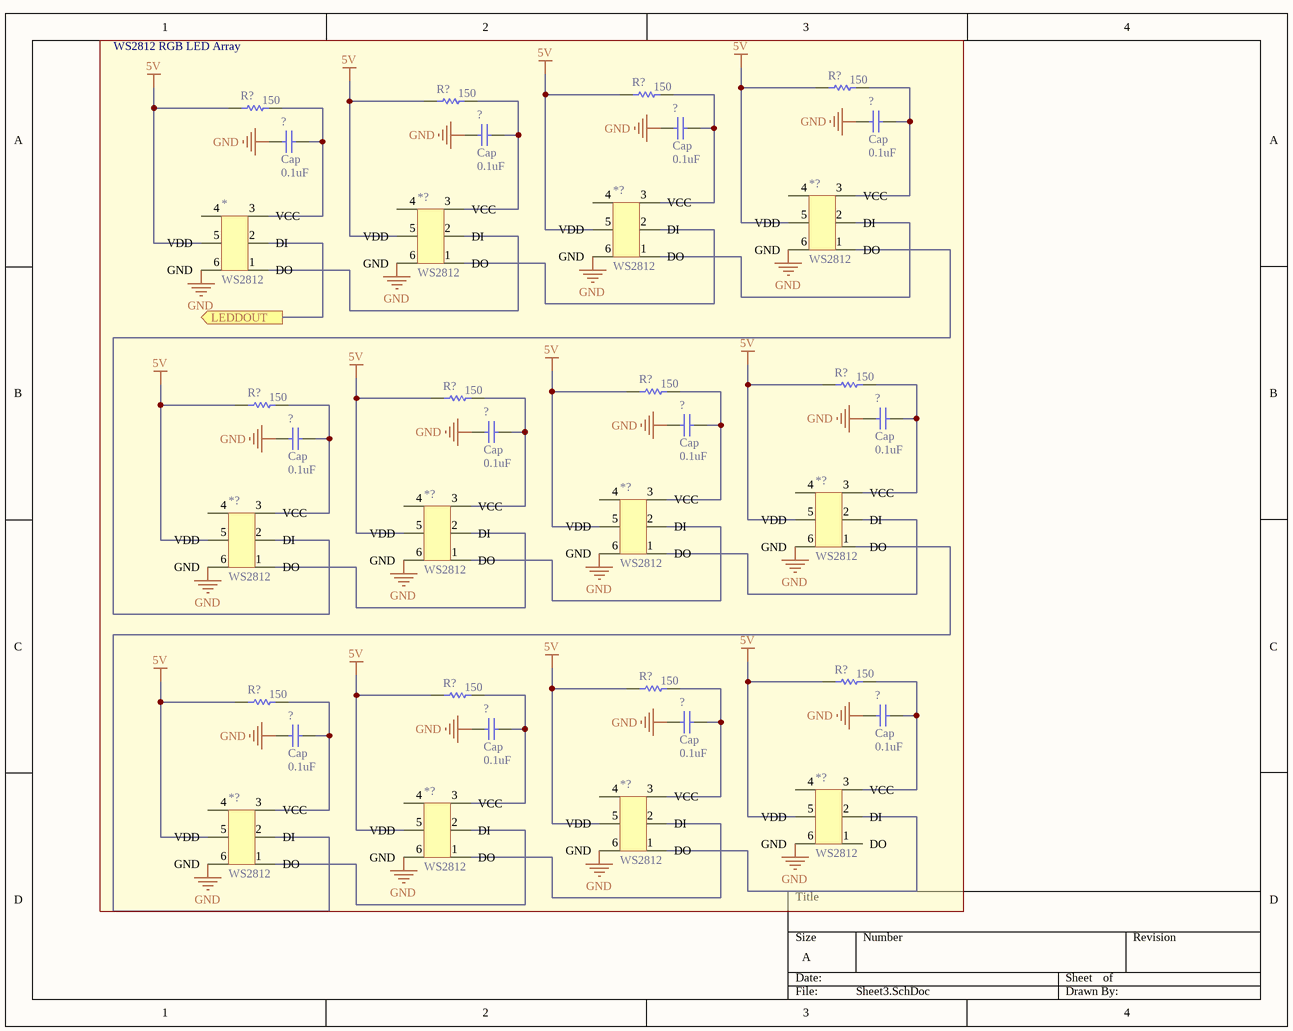
[diagram p2: Sheet3.SchDoc]

### Parts
(Parts that share a designator on the sheet are numbered #1, #2 ... from top to bottom, then left to right.)
*  WS2812
*?#1  WS2812
*?#2  WS2812
*?#3  WS2812
*?#4  WS2812
*?#5  WS2812
*?#6  WS2812
*?#7  WS2812
*?#8  WS2812
*?#9  WS2812
*?#10  WS2812
*?#11  WS2812
?#3  Cap  value 0.1uF  [RAD-0.3]
?#4  Cap  value 0.1uF  [RAD-0.3]
?#5  Cap  value 0.1uF  [RAD-0.3]
?#6  Cap  value 0.1uF  [RAD-0.3]
?#7  Cap  value 0.1uF  [RAD-0.3]
?#8  Cap  value 0.1uF  [RAD-0.3]
?#9  Cap  value 0.1uF  [RAD-0.3]
?#10  Cap  value 0.1uF  [RAD-0.3]
?#11  Cap  value 0.1uF  [RAD-0.3]
?#12  Cap  value 0.1uF  [RAD-0.3]
?#13  Cap  value 0.1uF  [RAD-0.3]
?#14  Cap  value 0.1uF  [RAD-0.3]
R?#15  value 150  [AXIAL-0.3]  (hidden comment: Res1)
R?#16  value 150  [AXIAL-0.3]  (hidden comment: Res1)
R?#17  value 150  [AXIAL-0.3]  (hidden comment: Res1)
R?#18  value 150  [AXIAL-0.3]  (hidden comment: Res1)
R?#19  value 150  [AXIAL-0.3]  (hidden comment: Res1)
R?#20  value 150  [AXIAL-0.3]  (hidden comment: Res1)
R?#21  value 150  [AXIAL-0.3]  (hidden comment: Res1)
R?#22  value 150  [AXIAL-0.3]  (hidden comment: Res1)
R?#23  value 150  [AXIAL-0.3]  (hidden comment: Res1)
R?#24  value 150  [AXIAL-0.3]  (hidden comment: Res1)
R?#25  value 150  [AXIAL-0.3]  (hidden comment: Res1)
R?#26  value 150  [AXIAL-0.3]  (hidden comment: Res1)

### Blocks framed on the sheet
WS2812 RGB LED Array: * *?#1-*?#11 ?#3-?#14 R?#15-R?#26

### Ports
LEDDOUT (out)

### Nets
5V: R?#15.2 R?#16.2 R?#17.2 R?#18.2 R?#19.2 R?#20.2 R?#21.2 R?#22.2 R?#23.2 R?#24.2 R?#25.2 R?#26.2
GND: ?#3.2 ?#4.2 ?#5.2 ?#6.2 ?#7.2 ?#8.2 ?#9.2 ?#10.2 ?#11.2 ?#12.2 ?#13.2 ?#14.2
Net?#3_1: ?#3.1 R?#15.1
Net?#4_1: ?#4.1 R?#16.1
Net?#5_1: ?#5.1 R?#17.1
Net?#6_1: ?#6.1 R?#18.1
Net?#7_1: ?#7.1 R?#19.1
Net?#8_1: ?#8.1 R?#20.1
Net?#9_1: ?#9.1 R?#21.1
Net?#10_1: ?#10.1 R?#22.1
Net?#11_1: ?#11.1 R?#23.1
Net?#12_1: ?#12.1 R?#24.1
Net?#13_1: ?#13.1 R?#25.1
Net?#14_1: ?#14.1 R?#26.1

Not connected (* = marked no-connect by the designer): * 1(DO) 2(DI) 3(VCC) 4 5(VDD) 6(GND); *?#1 1(DO) 2(DI) 3(VCC) 4 5(VDD) 6(GND); *?#2 1(DO) 2(DI) 3(VCC) 4 5(VDD) 6(GND); *?#3 1(DO) 2(DI) 3(VCC) 4 5(VDD) 6(GND); *?#4 1(DO) 2(DI) 3(VCC) 4 5(VDD) 6(GND); *?#5 1(DO) 2(DI) 3(VCC) 4 5(VDD) 6(GND); *?#6 1(DO) 2(DI) 3(VCC) 4 5(VDD) 6(GND); *?#7 1(DO) 2(DI) 3(VCC) 4 5(VDD) 6(GND); *?#8 1(DO) 2(DI) 3(VCC) 4 5(VDD) 6(GND); *?#9 1(DO) 2(DI) 3(VCC) 4 5(VDD) 6(GND); *?#10 1(DO) 2(DI) 3(VCC) 4 5(VDD) 6(GND); *?#11 1(DO) 2(DI) 3(VCC) 4 5(VDD) 6(GND)

### Notes on the sheet
- Labels drawn without touching a wire or pin: GND

### Library data of the parts
* *?#1-*?#11 = WS2812: http://cdn.sparkfun.com/datasheets/Components/LED/WS2812.pdf; ComponentLink1Description: Digikey; ComponentLink1URL: https://www.digikey.ca/product-detail/en/sparkfun-electronics/COM-11821/1568-1800-ND/6163706; ComponentLink2Description: Datasheet; ComponentLink2URL: http://cdn.sparkfun.com/datasheets/Components/LED/WS2812.pdf
?#3-?#14 = Cap: Capacitor; Published: 8-Jun-2000; LatestRevisionDate: 17-Jul-2002; LatestRevisionNote: Re-released for DXP Platform.; PackageReference: RAD-0.3; Publisher: Altium Limited; PackageDescription: Radial Cap, Thru-Hole; 2 Leads; 0.3 in Pin Spacing
R?#15-R?#26 = Res1: Resistor; Published: 8-Jun-2000; LatestRevisionDate: 17-Jul-2002; LatestRevisionNote: Re-released for DXP Platform.; PackageReference: AXIAL-0.3; Publisher: Altium Limited; PackageDescription: Axial Device, Thru-Hole; 2 Leads; 0.3 in Pin Spacing

## Sheet Sheet4.SchDoc
size A
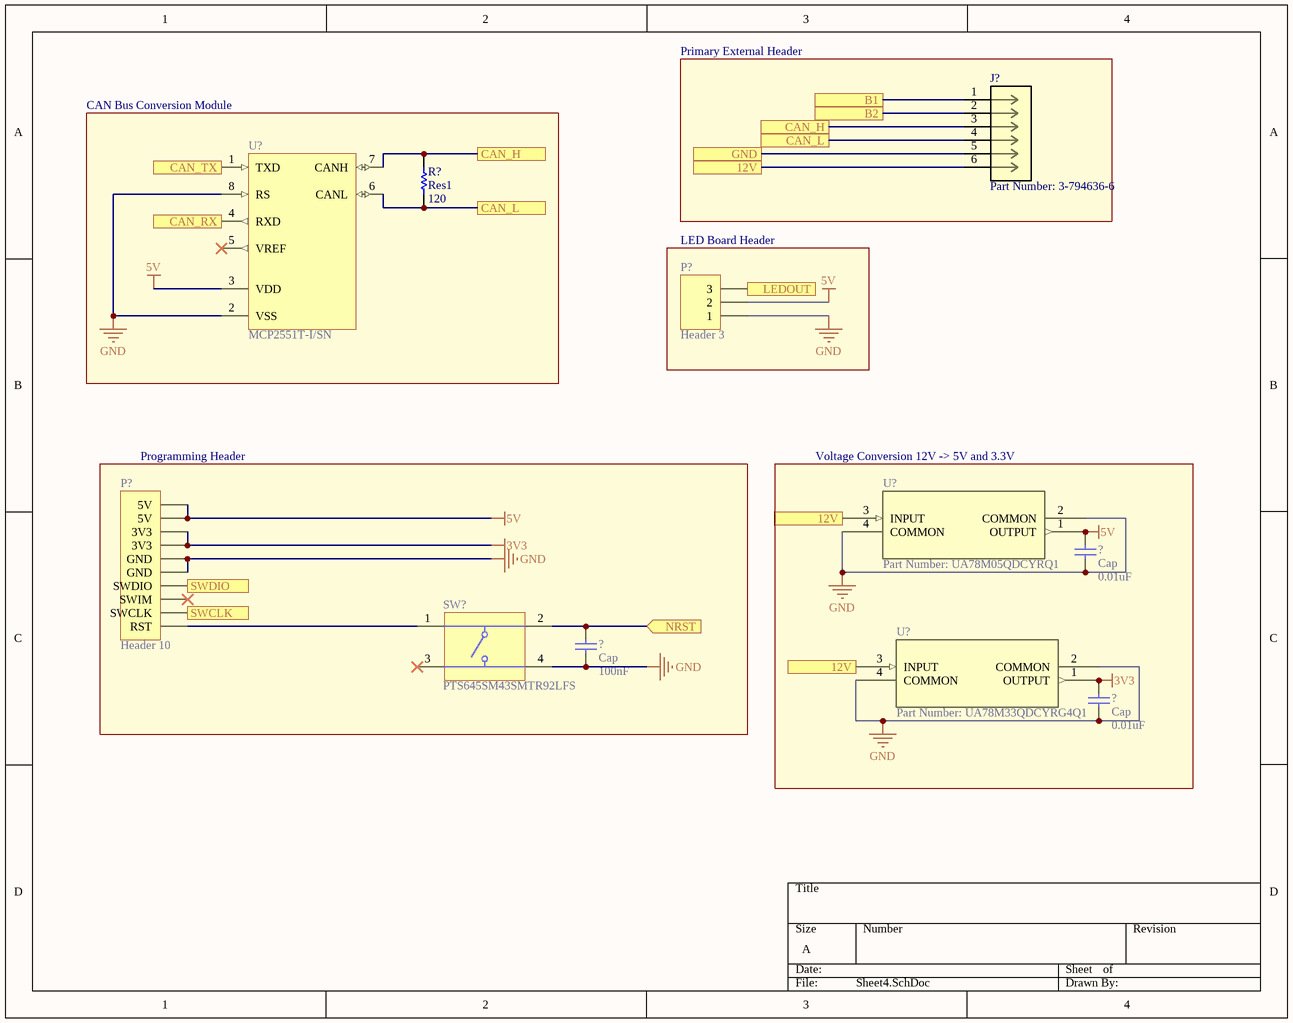
[diagram p3: Sheet4.SchDoc]

### Parts
(Parts that share a designator on the sheet are numbered #1, #2 ... from top to bottom, then left to right.)
?#15  Cap  value 0.01uF  [RAD-0.3]
?#16  Cap  value 100nF  [RAD-0.3]
?#17  Cap  value 0.01uF  [RAD-0.3]
J?#2  Part Number: 3-794636-6  [CON6_2X3_P3MM_VM]
P?#1  Header 3  [HDR1X3]
P?#2  Header 10  [HDR1X10]
R?#27  Res1  value 120  [AXIAL-0.3]
SW?  PTS645SM43SMTR92LFS  [ITT-PTS645S-4_V]
U?#4  MCP2551T-I/SN  [SOIC-SN8_L]
U?#5  Part Number: UA78M05QDCYRQ1  [DCY4]
U?#6  Part Number: UA78M33QDCYRG4Q1  [DCY4]

### Blocks framed on the sheet
Primary External Header: J?#2
CAN Bus Conversion Module: R?#27 U?#4
LED Board Header: P?#1
Programming Header: ?#16 P?#2 SW?
Voltage Conversion 12V -> 5V and 3.3V: ?#15 ?#17 U?#5 U?#6

### Ports
12V, B1, B2, CAN_H, CAN_L, CAN_RX, CAN_TX, GND, LEDOUT, NRST (in), SWCLK (in), SWDIO (in)

### Nets
3V3: ?#17.1 P?#2.7(3V3) P?#2.8(3V3) U?#6.1(OUTPUT)
5V: ?#15.1 P?#1.2 P?#2.9(5V) P?#2.10(5V) U?#4.3(VDD) U?#5.1(OUTPUT)
GND: ?#15.2 ?#16.1 ?#17.2 P?#1.1 P?#2.5(GND) P?#2.6(GND) SW?.4 U?#4.2(VSS) U?#4.8(RS) U?#5.2(COMMON) U?#5.4(COMMON) U?#6.2(COMMON) U?#6.4(COMMON)
Net?#16_2: ?#16.2 SW?.2 ; port NRST
NetJ?#1_13: J?#2.1 ; port B1
NetJ?#1_14: J?#2.2 ; port B2
NetJ?#2_3: J?#2.3 R?#27.2 U?#4.7(CANH) ; port CAN_H
NetJ?#2_4: J?#2.4 R?#27.1 U?#4.6(CANL) ; port CAN_L
NetJ?#2_5: J?#2.5 ; port GND
NetJ?#2_6: J?#2.6 U?#5.3(INPUT) U?#6.3(INPUT) ; port 12V
NetP?#1_3: P?#1.3 ; port LEDOUT
NetP?#2_1: P?#2.1(RST) SW?.1
NetP?#2_2: P?#2.2(SWCLK) ; port SWCLK
NetP?#2_4: P?#2.4(SWDIO) ; port SWDIO
NetU?#1_114: U?#4.4(RXD) ; port CAN_RX
NetU?#1_115: U?#4.1(TXD) ; port CAN_TX

Not connected (* = marked no-connect by the designer): P?#2 3(SWIM)*; SW? 3*; U?#4 5(VREF)*

### Library data of the parts
?#15-?#17 = Cap: Capacitor; Published: 8-Jun-2000; LatestRevisionDate: 17-Jul-2002; LatestRevisionNote: Re-released for DXP Platform.; PackageReference: RAD-0.3; Publisher: Altium Limited; PackageDescription: Radial Cap, Thru-Hole; 2 Leads; 0.3 in Pin Spacing
J?#2 = 3-794636-6: No Description Available; Vendor: TE Connectivity; Built_By: EMA_UL_Team; Manufacturer_Part_Number: 3-794636-6; Copyright: Copyright (C) 2018 Accelerated Designs. All rights reserved; RefDes: RefDes; Type: DEV; Value: Value
P?#1 = Header 3: Header, 3-Pin; LatestRevisionDate: 17-Jul-2002; LatestRevisionNote: Re-released for DXP Platform.; Publisher: Altium Limited
P?#2 = Header 10: Header, 10-Pin; LatestRevisionDate: 17-Jul-2002; LatestRevisionNote: Re-released for DXP Platform.; Publisher: Altium Limited
R?#27 = Res1: Resistor; Published: 8-Jun-2000; LatestRevisionDate: 17-Jul-2002; LatestRevisionNote: Re-released for DXP Platform.; PackageReference: AXIAL-0.3; Publisher: Altium Limited; PackageDescription: Axial Device, Thru-Hole; 2 Leads; 0.3 in Pin Spacing
SW? = CMP-2000-05160-1: 6 mm Tact Switche, SPST, NO, -20 to 60 degC, 4-Pin SMT, RoHS, Tape and Reel; Manufacturer: ITT Cannon; Manufacturer URL: http://www.ittcannon.com/; Datasheet Version: Feb-14; Datasheet URL: https://datasheet.ciiva.com/29903/getdatasheetpartid-786341-29903846.pdf
U?#4 = CMP-0186-00037-2: High-Speed CAN Transceiver, 8-Pin SOIC, Industrial Temperature, Tape and Reel; RevisionNote: URLs added. DatasheetVersion updated.; DatasheetVersion: revF, Jul-2010; PackageReference: SOIC-SN8; ComponentLink3URL: http://www.microchip.com/stellent/groups/techpub_sg/documents/packagingspec/en012702.pdf; Code_IPC: SOIC127P600-8; ComponentLink3Description: Package Specification; Code_JEDEC: MS-012; ComponentLink2Description: Datasheet; ComponentLink1URL: http://www.microchip.com/; PackageDescription: 8-Lead Plastic Small Outline (SN) - Narrow, 3.90mm Body [SOIC]; ComponentLink2URL: http://ww1.microchip.com/downloads/en/DeviceDoc/21667F.pdf; PackageVersion: revBB, Aug-2009; ComponentLink1Description: Manufacturer URL
U?#5 U?#6 = UA78M05QDCYRQ1: No Description Available; Vendor: Texas Instruments; Built_By: EMA_UL_Team; Manufacturer_Part_Number: UA78M05QDCYRQ1; Manufacturer: Texas Instruments; Copyright: Copyright (C) 2018 Accelerated Designs. All rights reserved; RefDes: RefDes; Type: DEV; Value: Value

## Nets that join several sheets
3V3: Sheet1 (6 pins), Sheet2 (36 pins), Sheet4 (?#17.1 P?#2.7 P?#2.8 U?#6.1)
5V: Sheet1 (C?#3.1 L?.1 U?#2.4 U?#2.5), Sheet2 (12 pins), Sheet3 (12 pins), Sheet4 (6 pins)
GND: Sheet1 (13 pins), Sheet2 (46 pins), Sheet3 (12 pins), Sheet4 (13 pins)
Net?#16_2: Sheet1 (J?#1.8), Sheet4 (?#16.2 SW?.2)
NetJ?#1_9: Sheet1 (J?#1.9), Sheet2 (U?#3.22)
NetJ?#1_10: Sheet1 (J?#1.10), Sheet2 (U?#3.19)
NetJ?#1_11: Sheet1 (J?#1.11), Sheet2 (U?#3.21)
NetJ?#1_12: Sheet1 (J?#1.12), Sheet2 (U?#3.3)
NetJ?#1_13: Sheet1 (J?#1.13 R?#3.2), Sheet2 (U?#3.127), Sheet4 (J?#2.1)
NetJ?#1_14: Sheet1 (J?#1.14 R?#4.2 U?#1.122), Sheet2 (U?#3.125), Sheet4 (J?#2.2)
NetJ?#1_15: Sheet1 (J?#1.15 U?#1.79), Sheet2 (U?#3.126)
NetJ?#1_16: Sheet1 (J?#1.16), Sheet2 (U?#3.65)
NetJ?#1_20: Sheet1 (J?#1.20), Sheet2 (U?#3.4)
NetJ?#1_21: Sheet1 (J?#1.21), Sheet2 (U?#3.5)
NetJ?#1_23: Sheet1 (J?#1.23), Sheet2 (U?#3.64)
NetJ?#1_35: Sheet1 (J?#1.35), Sheet2 (U?#3.68 U?#3.91)
NetJ?#1_38: Sheet1 (J?#1.38 R?#8.2), Sheet2 (U?#3.92)
NetP?#2_2: Sheet1 (U?#1.109), Sheet4 (P?#2.2)
NetP?#2_4: Sheet1 (U?#1.105), Sheet4 (P?#2.4)
NetU?#1_114: Sheet1 (U?#1.114), Sheet4 (U?#4.4)
NetU?#1_115: Sheet1 (U?#1.115), Sheet4 (U?#4.1)